# Altium schematic sheet Fuente-12V.SchDoc
size Letter; ApprovedBy: M. en C. Fernando Bolaños; CheckedBy: M. en C. José Alberto Balderas Castillo (CID); Author: M. en C. José Alberto Balderas Castillo (CID); Revision: v2; NombreTarjeta: TELCOMSATGPRS-v2; NumeroDeHoja: 2 de 7; NombreBloque: Fuentes de alimentacion conmutadas de DC-DC; FechaDiseno: AGOSTO 2015; FechaRevision: AGOSTO 2015; FechaAprobacion: AGOSTO 2015; TamanoHoja: Carta; NombreProyecto: Telemetria GPRS y Satelital
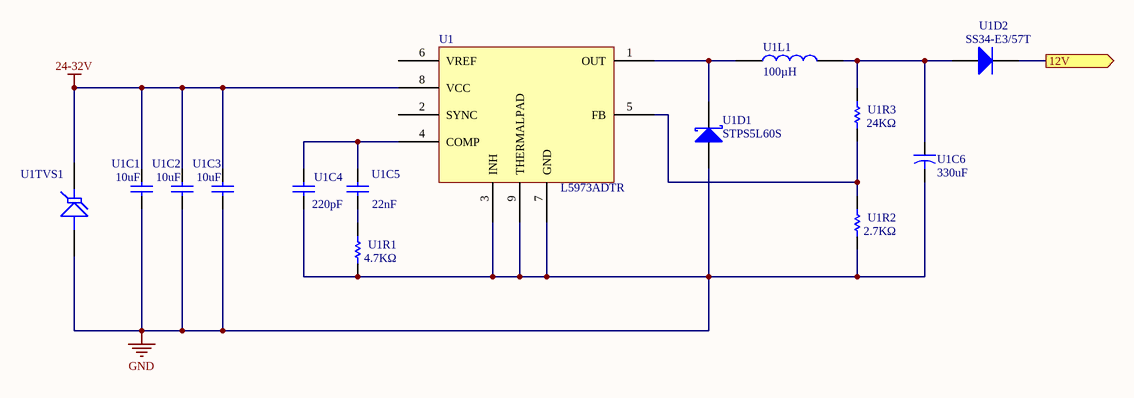
[diagram p0: Fuente-12V.SchDoc]

## Parts
U1  L5973ADTR  [SOIC-8-T]
U1C1  10uF  [1210-CAP]
U1C2  10uF  [1210-CAP]
U1C3  10uF  [1210-CAP]
U1C4  220pF  [1206-CAP]
U1C5  22nF  [1206-CAP]
U1C6  value 330uF  [CAPPR3.5-8x11.5]  (hidden comment: ECA-1EM331)
U1D1  STPS5L60S  [DO-214AB]
U1D2  SS34-E3/57T  [DO-214AB]
U1L1  100µH  [1280-IND]
U1R1  4.7KΩ  [1206-RES]
U1R2  2.7KΩ  [0805-RES]
U1R3  24KΩ  [0805-RES]
U1TVS1  33V  [DO-15]  (value not drawn)

## Ports
12V (out)

## Nets
24-32V: U1.8(VCC) U1C1.2 U1C2.2 U1C3.2 U1TVS1.2(K)
GND: U1.3(INH) U1.7(GND) U1.9(THERMALPAD) U1C1.1 U1C2.1 U1C3.1 U1C4.1 U1C6.2 U1D1.1(A) U1R1.1 U1R2.2 U1TVS1.1(A)
12V: U1D2.2(K) ; port 12V
NetU1_1: U1.1(OUT) U1D1.2(K) U1L1.1
NetU1_4: U1.4(COMP) U1C4.2 U1C5.2
NetU1_5: U1.5(FB) U1R2.1 U1R3.2
NetU1C5_1: U1C5.1 U1R1.2
NetU1C6_1: U1C6.1 U1D2.1(A) U1L1.2 U1R3.1

Not connected (* = marked no-connect by the designer): U1 2(SYNC) 6(VREF)

## Notes on the sheet
- Elaboró
- Fecha
- Nombre del artículo
- Revisó
- Aprobó
- Número de parte
- Revisión
- Escala
- N/A
- Sección afectada
- Descripción del cambio
- Lámina
- 1/1
- Tolerancias
- Ruta del archivo

## Library data of the parts
U1 = L5973AD: IC REG SW 2A STEPDOWN 8-SOIC; Manufacturer: STMicroelectronics; Supplier 1: Digi-Key; Supplier Part Number 1: 497-5328-1-ND; Manufacturer Part Number: L5973ADTR
U1C1-U1C3 = Cap: CAP CER 10UF 50V Y5V 1210; Manufacturer Part Number: CC1210ZKY5V9BB106; Manufacturer: Yageo; Temporary Manufacturer Part Number: CL32B106KLULNNE; Temporary Manufacturer: Samsung Electro-Mechanics; Temporay Part Description: CAP CER 10UF 35V X7R 1210; Value: 10uF; Supplier 2: Mouser; Supplier Part Number 2: 603-CC121ZKY5V9BB106; Supplier 1: Digi-Key; Supplier Part Number 1: 311-3470-1-ND; Temporary Supplier 1: Digi-Key; Temporary Supplier Part Number 1: 1276-3323-1-ND
U1C4 = Cap: CAP CERAMIC 220PF 50V NP0 1206; Manufacturer: Kemet; Manufacturer Part Number: C1206C221K5GACTU; Revision: July-2002: Re-released for DXP Platform.; Value: 220pF; Supplier 1: Digi-Key; Supplier Part Number 1: 399-1208-1-ND
U1C5 = Cap: CAP 22000PF 50V CERAMIC X7R 1206; Manufacturer: Kemet; Manufacturer Part Number: C1206C223K5RACTU; Revision: July-2002: Re-released for DXP Platform.; Value: 22nF; Supplier 1: Digi-Key; Supplier Part Number 1: 399-1242-1-ND
U1C6 = Cap2: Capacitor; Manufacturer: PANASONIC ELECTRONIC COMPONENTS; Manufacturer Part Number: ECA-1EM331B; Supplier 1: Newark; Supplier Part Number 1: 48W7648; Supplier 2: Mouser; Supplier Part Number 2: 667-ECA-1EM331B
U1D1 = D Schottky: DIODE SCHOTTKY 60V 5A SMC; Manufacturer Part Number: B560C-13-F; Manufacturer: Diodes Incorporated; Revision: July-2002: Re-released for DXP Platform.; Supplier 1: Digi-Key; Supplier Part Number 1: B560C-FDICT-ND
U1D2 = Diode: DIODE SCHOTTKY 40V 3A SMC; Manufacturer Part Number: B340-13-F; Manufacturer: Diodes Incorporated; Revision: July-2002: Re-released for DXP Platform.; Supplier 1: Digi-Key; Supplier Part Number 1: B340-FDICT-ND
U1L1 = IND: WE-PD SMD Shielded Power Inductor 100uH; Manufacturer Part Number: 74477020; Manufacturer: Wurth Elektronik; Supplier Part Number 1: 74477020; Supplier 1: Wurth Elektronik; Value: 100µH
U1R1 = Res1: RES 4.7K OHM 1/4W 5% 1206 SMD; Manufacturer Part Number: CRCW12064K70JNEA; Manufacturer: Vishay Dale; Revision: July-2002: Re-released for DXP Platform.; Value: 4.7KΩ; Supplier 1: Digi-Key; Supplier Part Number 1: 541-4.7KECT-ND
U1R2 = Res1: RES 2.70K OHM 1/8W 1% 0805 SMD; Manufacturer: Vishay Dale; Manufacturer Part Number: CRCW08052K70FKEA; Revision: July-2002: Re-released for DXP Platform.; Value: 2.7KΩ; Supplier 1: Digi-Key; Supplier Part Number 1: 541-2.70KCCT-ND
U1R3 = Res1: Manufacturer Part Number: ERA-6AEB3162V; Manufacturer: Panasonic Electronic Components; Revision: July-2002: Re-released for DXP Platform.; Value: 24KΩ; Supplier 1: Digi-Key; Supplier Part Number 1: P31.6KDACT-ND
U1TVS1 = Tranzorb: TVS 33 VOLT 600 WATT UNI-DIR TRANZORB; Manufacturer Part Number: P6KE33A; Manufacturer: Littelfuse Inc.; Supplier 1: Digi-Key; Supplier Part Number 1: P6KE33ALFCT-ND